# EasyEDA Pro project ProProject_FOC系列_2024-04-21.epro

# Schematic Schematic1
Create Date: 2023-11-13; Page Name: P1; Project Name: FOC系列; Schematic Name: Schematic1; Update Date: 2024-04-19; Company: 嘉立创EDA; Page Size: A4; Version: V1.0
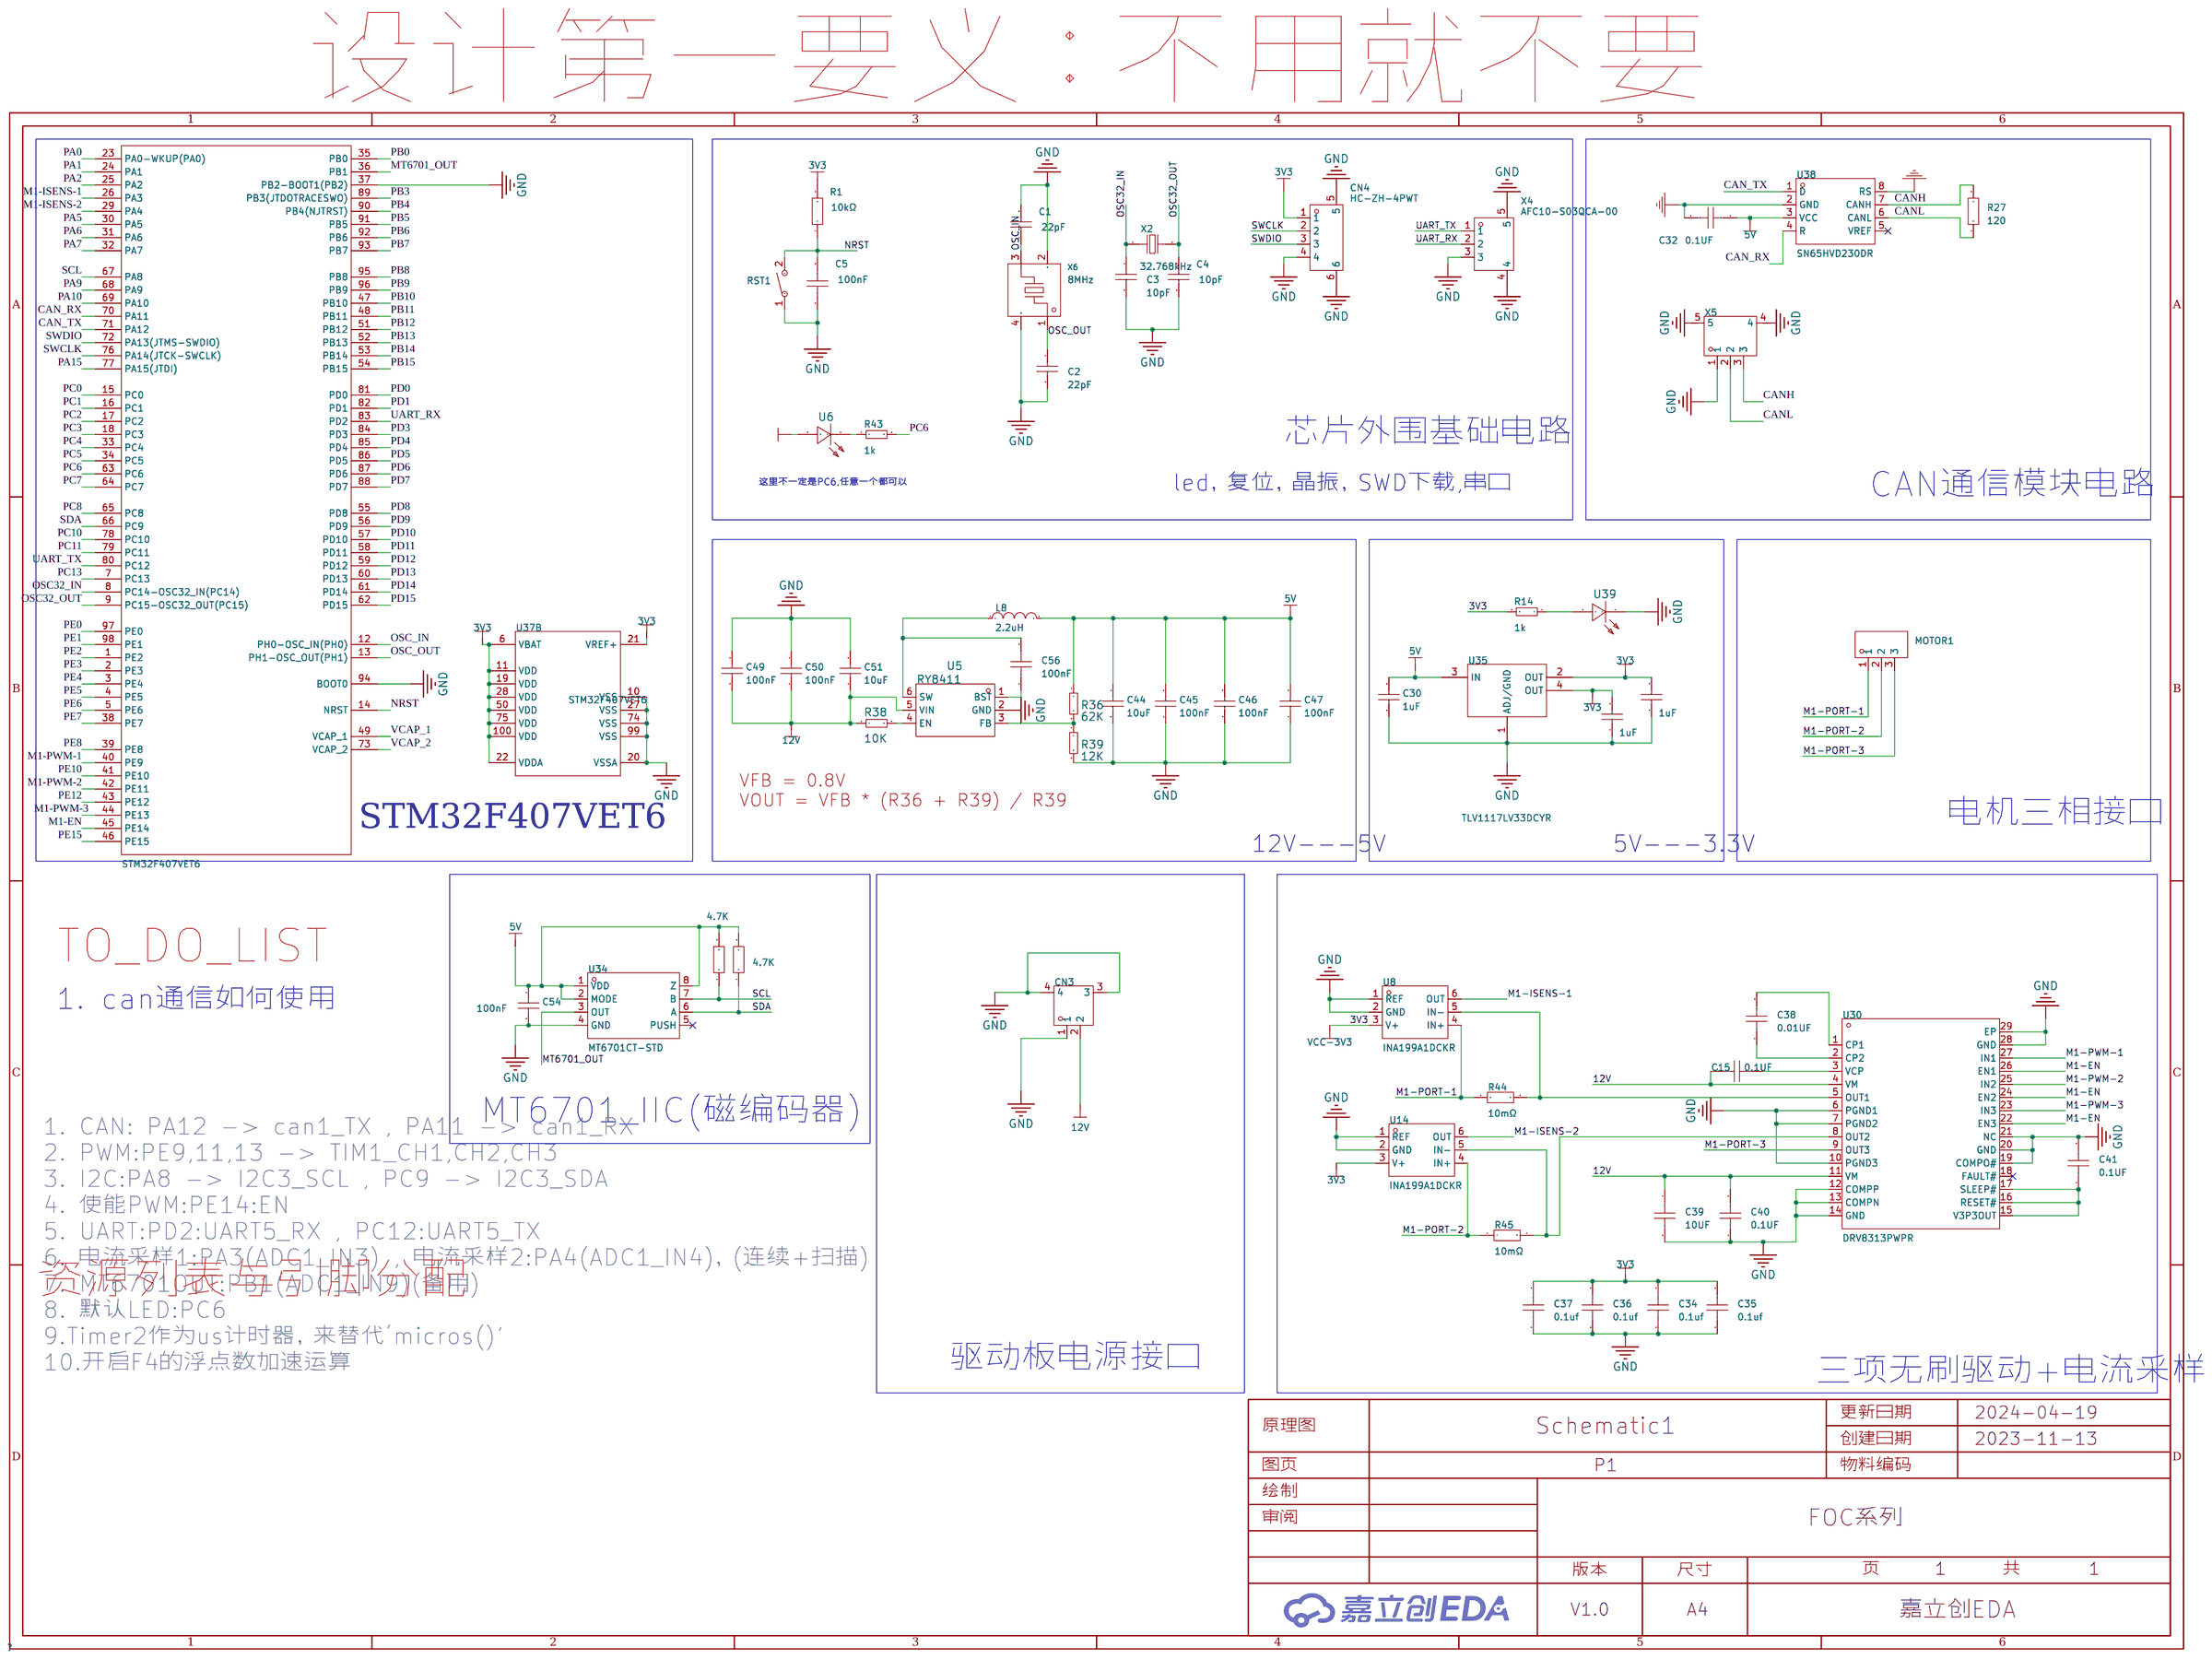
[diagram p0: schematic sheet]

## Parts
C1  22pF  [C0603]
C2  22pF  [C0603]
C3  10pF  [C0603]
C4  10pF  [C0603]
C5  100nF  [C0603]
C15  0.1UF  [c0603]
C30  1uF  [C0603_S]
C31  1uF  [C0603_S]
C32  0.1UF  [c0603]
C34  0.1uf  [c0603]
C35  0.1uf  [c0603]
C36  0.1uf  [c0603]
C37  0.1uf  [c0603]
C38  0.01UF  [c0603]
C39  10UF  [c0603]
C40  0.1UF  [c0603]
C41  0.1UF  [c0603]
C44  10uF  [C0805_S]
C45  100nF  [C0603_S]
C46  100nF  [C0603_S]
C47  100nF  [C0603_S]
C49  100nF  [C0603_S]
C50  100nF  [C0603_S]
C51  10uF  [C0603_S]
C54  100nF  [C0603_S]
C55  1uF  [C0603_S]
C56  100nF  [c0603]
CN3  XT30PW-M  [CONN-TH_XT30PW-M]
CN4  HC-ZH-4PWT  [CONN-SMD_4P-P1.50_HC-ZH-4PW]
L8  2.2uH  [IND-SMD_L3.0-W3.0]
MOTOR1  MR30-M  [mr30]
R1  10kΩ  [R0603]
R14  1k  [R0603_S]
R27  120  [r0603]
R36  62K  [R0603_S]
R38  10K  [R0603_S]
R39  12K  [R0603_S]
R41  4.7K  [R0603]
R42  4.7K  [R0603]
R43  1k  [R0603_S]
R44  10mΩ  [R1206]
R45  10mΩ  [R1206]
RST1  TS-1092S-B3D2-G  [SW-SMD_L6.1-W3.6-LS7.9]
U5  RY8411  [sot-23-6_l2.9-w1.6-p0.95-ls2.8-br]
U6  LED0603R-红色  [LED0603-RD]
U8  INA199A1DCKR  [SC-70-6_L2.0-W1.3-P0.65-LS2.1-BR]
U14  INA199A1DCKR  [SC-70-6_L2.0-W1.3-P0.65-LS2.1-BR]
U30  DRV8313PWPR  [HTSSOP-28_L9.8-W4.5-P0.65-LS6.6-BL-EP]
U34  MT6701CT-STD  [SOP-8_L4.9-W3.9-P1.27-LS6.0-BL]
U35  TLV1117LV33DCYR  [SOT-223_L6.7-W3.5-P2.30-BR]
U37  STM32F407VET6  [LQFP-100_L14.0-W14.0-P0.50-LS16.0-BL]  (sections 1,2)
U38  SN65HVD230DR  [SOIC-8_L4.9-W3.9-P1.27-LS6.0-BL]
U39  LED0603R-红色  [LED0603-RD]
X2  32.768kHz  [FC-135R_L3.2-W1.5]
X4  AFC10-S03QCA-00  [CONN-SMD_AFC10-S03QCA-00]
X5  AFC10-S03QCA-00  [CONN-SMD_AFC10-S03QCA-00]
X6  8MHz  [OSC-SMD_4P-L3.2-W2.5-BL]

## Library data of the parts
C1 C2 = CL10C220JB8NNNC: 容值:22pF;精度:±5%;额定电压:50V;材质(温度系数):C0G;; LCSC Part Name: 22pF ±5% 50V; Supplier Part: C1653; Manufacturer: SAMSUNG(三星); Supplier Footprint: 0603; JLCPCB Part Class: 基础库; Datasheet: https://atta.szlcsc.com/upload/public/pdf/source/20160103/1457707687317.pdf; Supplier: LCSC; Tolerance: ±5%; Voltage Rated: 50V; Temperature Coefficient: C0G
C3 C4 = CL10C100JB8NNNC: 容值:10pF;精度:±5%;额定电压:50V;材质(温度系数):C0G;; LCSC Part Name: 10pF ±5% 50V; Supplier Part: C1634; Manufacturer: SAMSUNG(三星); Supplier Footprint: 0603; JLCPCB Part Class: 基础库; Datasheet: https://atta.szlcsc.com/upload/public/pdf/source/20160103/1457707686163.pdf; Supplier: LCSC; Tolerance: ±5%; Voltage Rated: 50V; Temperature Coefficient: C0G
C5 = CC0603KRX7R9BB104: 容值:100nF;精度:±10%;额定电压:50V;材质(温度系数):X7R;; LCSC Part Name: 100nF ±10% 50V; Supplier Part: C14663; Manufacturer: YAGEO(国巨); Supplier Footprint: 0603; JLCPCB Part Class: 基础库; Datasheet: https://atta.szlcsc.com/upload/public/pdf/source/20170116/1484561234239.pdf; Supplier: LCSC; Tolerance: ±10%; Voltage Rated: 50V; Temperature Coefficient: X7R
C15 C32 C34-C41 = CAP_0805: Supplier Footprint: 0805
C30 C31 C45-C47 C49-C51 C54 C55 = C0603_S: Pin Type: IN
C44 = C0805_S: Pin Type: IN
C56 = CAP_0603: Supplier Footprint: 0603
CN3 = XT30PW-M: Socket,DCsupply,XT30,male,PIN:2; LCSC Part Name: AMASS(艾迈斯)航模插头 卧式弯脚 XT30PW-M公头; Supplier Part: C431092; Manufacturer: AMASS(艾迈斯); JLCPCB Part Class: 扩展库; Datasheet: https://atta.szlcsc.com/upload/public/pdf/source/20220222/6A9F22F7850E25B33E1BE430ADF8560B.pdf; Supplier: LCSC
CN4 = HC-ZH-4PWT: 参考系列:-;间距:1.5mm;插针结构:1x4P;排数:1;每排PIN数:4;行距:-;公母:公型插针;安装方式:卧贴;额定电流:2A;工作温度范围:-25℃~+85℃;; LCSC Part Name: 间距:1.5mm 1x4P 卧贴; Supplier Part: C2845426; Manufacturer: HCTL(华灿天禄); Supplier Footprint: SMD,P=1.5mm; JLCPCB Part Class: 扩展库; Datasheet: https://atta.szlcsc.com/upload/public/pdf/source/20230711/DA9605CC4FFDBF9FBAAF660CE8700658.pdf; Supplier: LCSC; Pitch: 1.5mm; Pins Structure: 1x4P; Number of Rows: 1; Number of PINs Per Row: 4; Gender: 公型插针; Mounting Style: 卧贴; Current Rating (Max): 2A; Operating Temperature Range: -25℃~+85℃
L8 = SWPA3015S2R2MT: 电感值:2.2uH;精度:±20%;额定电流:2A;; LCSC Part Name: 2.2uH ±20% 2A; Supplier Part: C43389; Manufacturer: Sunlord(顺络); Supplier Footprint: SMD; JLCPCB Part Class: 扩展库; Datasheet: https://atta.szlcsc.com/upload/public/pdf/source/20210916/AC798BA7E846B7D0B6818F45CD84DB0B.pdf; Supplier: LCSC; Tolerance: ±20%; Rated Current: 2A
MOTOR1 = MR30-M: 模型锂电连接器（两件套） 三芯; LCSC Part Name: AMASS(艾迈斯)锂电池三芯电源连接器公头MR30-M 2件套; Supplier Part: C99873; Manufacturer: AMASS(艾迈斯); JLCPCB Part Class: 扩展库; Datasheet: https://atta.szlcsc.com/upload/public/pdf/source/20170412/1491969315720.pdf; Supplier: LCSC
R1 = 0603WAF1002T5E: 电阻类型:厚膜电阻;阻值:10kΩ;精度:±1%;功率:100mW;温度系数:±100ppm/;最大工作电压:75V;工作温度范围:-55~+155;; LCSC Part Name: 10kΩ ±1% 100mW; Supplier Part: C25804; Manufacturer: UNI-ROYAL(厚声); Supplier Footprint: 0603; JLCPCB Part Class: 基础库; Datasheet: https://atta.szlcsc.com/upload/public/pdf/source/20200306/C422600_1E6D84923E4A46A82E41ADD87F860B5C.pdf; Supplier: LCSC; Type: 厚膜电阻; Tolerance: ±1%; Power(Watts): 100mW; Temperature Coefficient: ±100ppm/; Overload Voltage (Max): 75V; Operating Temperature Range: -55~+155
R14 R43 = R0603_S: Pin Type: IN
R27 = Res_0805: Supplier Footprint: 0805
R36 R38 R39 = R0603_S: Pin Type: IN; Manufacturer: UNI-ROYAL(厚声); Manufacturer Part: 0805W8F1001T5E; Supplier: LCSC; Supplier Part: C17513; 美岩编码: A00010; 单价: 0.009222
R41 R42 = Res_0603: Supplier Footprint: 0603
R44 R45 = RLM12FTCMR010: 阻值:10mΩ;精度:±1%;功率:1W;; LCSC Part Name: 10mΩ ±1% 1W; Supplier Part: C188070; Manufacturer: 大毅科技; Supplier Footprint: 1206; JLCPCB Part Class: 扩展库; Datasheet: https://atta.szlcsc.com/upload/public/pdf/source/20180329/C188070_3C58080BE0BA7DFA5ED79A3DCBDAA889.pdf; Supplier: LCSC; Tolerance: ±1%; Power(Watts): 1W; Temperature Coefficient: ±100ppm/℃
RST1 = TS-1092S-B3D2-G: 电路结构:单刀单掷;安装方式:立贴;按钮形状:矩形按钮;按钮/盖帽颜色:灰色;作用力:250gf@±30gf;引脚样式:鸥翼型;开关长度:6.1mm;开关宽度:3.6mm;开关高度:2.5mm;带支架:否;; LCSC Part Name: 轻触开关3.6*6.1*2.5灰头两脚贴片按键250gf; Supplier Part: C520860; Manufacturer: Yuandi(元迪); Supplier Footprint: SMD; JLCPCB Part Class: 扩展库; Datasheet: https://atta.szlcsc.com/upload/public/pdf/source/20200424/C520860_DA5AE47D9A9DC527FC720B5FF0895739.pdf; Supplier: LCSC; Circuit: 单刀单掷; Mounting Style: 立贴; Actuator Style: 矩形按钮; Actuator/Cap Color: 灰色; Operating Force: 250gf@±30gf; Pin Style: 鸥翼型; Switch Length: 6.1mm; Switch Width: 3.6mm; Switch Height: 2.5mm; Strike Gundam: 否
U5 = TD1466: Supplier: LCSC; Supplier Part: C185109; Manufacturer: JoulWatt Tech; Manufacturer Part: JW5026; JLCPCB Part Class: Extended Part
U6 U39 = LED0603R-红色: Supplier: LCSC; Supplier Part: C9900007960; Manufacturer: null; JLCPCB Part Class: Extended Part
U8 U14 = INA199B1DCKR: INA199 26V、双向、零漂移、低侧/高侧、电压输出分流监控器; Supplier Part: C398920; Manufacturer: TI(德州仪器); Supplier Footprint: SC-70-6; JLCPCB Part Class: 扩展库; Datasheet: https://atta.szlcsc.com/upload/public/pdf/source/20190618/C398920_11F1AA1C0E9C9D9BC4E845E2D57884D2.pdf; Supplier: LCSC
U30 = DRV8313PWPR: 类型:无刷直流BLDC;电源电压:8V~60V;输出电流:-;接口:并行;; Supplier Part: C92482; Manufacturer: TI(德州仪器); Supplier Footprint: HTSSOP-28-EP-4.5mm; JLCPCB Part Class: 扩展库; Datasheet: https://atta.szlcsc.com/upload/public/pdf/source/20180307/C92482_15204091381071407760.pdf; Supplier: LCSC; Type: 无刷直流BLDC; Supply Voltage: 8V~60V; Interface: 并行; Operating Temperature: -40℃~+150℃@(Tj)
U34 = MT6701CT-STD: 磁性编码器 磁性编码开关 磁性角度检测IC 可编程磁性角度位置芯片; LCSC Part Name: 霍尔在线编程角度位置传感器; Supplier Part: C2856764; Manufacturer: MagnTek(麦歌恩); Supplier Footprint: SOP-8; JLCPCB Part Class: 扩展库; Datasheet: https://atta.szlcsc.com/upload/public/pdf/source/20210901/89396AA55DF26524CEF7734A3D9C2FB3.pdf; Supplier: LCSC
U35 = TLV1117LV33DCYR: 输出类型:固定;输出极性:正;最大输入电压:5.5V;输出电压:3.3V;输出电流:1A;电源纹波抑制比(PSRR):75dB@(120Hz);; LCSC Part Name: 输入5.5V 输出3.3V 1A; Supplier Part: C15578; Manufacturer: TI(德州仪器); Supplier Footprint: SOT-223; JLCPCB Part Class: 扩展库; Datasheet: https://atta.szlcsc.com/upload/public/pdf/source/20140704/1457707105729.pdf; Supplier: LCSC; Output Type: 固定; Output Polarity: 正; Number of Outputs: 1; Maximum Input Voltage: 5.5V; Output Voltage: 3.3V; Dropout Voltage: 1.3V@(800mA); Output Current: 1A; Power Supply Rejection Ratio (PSRR): 75dB@(120Hz)
U37 = STM32F407VET6: CPU内核:ARM Cortex-M4;CPU最大主频:168MHz;工作电压范围:1.8V~3.6V;程序存储容量:512KB;程序存储器类型:FLASH;RAM总容量:192KB;GPIO端口数量:82;; Supplier Part: C28730; Manufacturer: ST(意法半导体); Supplier Footprint: LQFP-100(14x14); JLCPCB Part Class: 扩展库; Datasheet: https://atta.szlcsc.com/upload/public/pdf/source/20140801/1457707197138.pdf; Supplier: LCSC; CPU Core: ARM Cortex-M4; CPU Maximum Speed: 168MHz; Operating Voltage Range: 1.8V~3.6V; Program Storage Size: 512KB; Program Memory Type: FLASH; RAM Size: 192KB; GPIO Ports Number: 82; ADC (Bit): 12bit; DAC (Bit): 12bit; Universal Serial Bus: 有; Peripheral/Function: DMA；LCD/LED驱动；PWM; Watchdog: 有; Infrared Data Association: 有; Low-Voltage Detect: 有; LCD Module: 有; Direct Memory Access: 有; Internal Oscillator: 有; Operating Temperature Range: -40℃~+85℃
U38 = SN65HVD230DR: 类型:收发器;数据速率:1Mbps;; LCSC Part Name: 1Mbps 3V~3.6V; Supplier Part: C12084; Manufacturer: TI(德州仪器); Supplier Footprint: SOIC-8; JLCPCB Part Class: 扩展库; Datasheet: https://atta.szlcsc.com/upload/public/pdf/source/20140508/1457707055452.pdf; Supplier: LCSC; Type: 收发器; Data Rate: 1Mbps; Supply Voltage: 3V~3.6V
X2 = Q13FC1350000400: 晶振类型:贴片无源晶振;频率:32.768kHz;频率公差:±20ppm;负载电容:12.5pF;等效串联电阻(ESR):70kΩ;工作温度:-40~+85;; LCSC Part Name: 32.768kHz ±20ppm 12.5pF; Supplier Part: C32346; Manufacturer: EPSON(爱普生); Supplier Footprint: SMD3215-2P; Datasheet: https://atta.szlcsc.com/upload/public/pdf/source/20190108/C32346_746D6B07EAF90824457A96480007685F.pdf; Supplier: LCSC; Crystal Type: 贴片无源晶振; Frequency Tolerance: ±20ppm; Load Capacitance: 12.5pF; Equivalent Series Resistance (ESR): 70kΩ; Operating Temperature: -40~+85
X4 X5 = AFC10-S03QCA-00: 参考系列:SH;间距:1mm;插针结构:1x3P;排数:1;每排PIN数:3;行距:-;公母:公型插针;安装方式:卧贴;额定电流:500mA;工作温度范围:-25℃~+85℃;; LCSC Part Name: 系列:SH 间距:1mm 1x3P 卧贴; Supplier Part: C2764182; Manufacturer: JS(钜硕电子); Supplier Footprint: SMD,P=1mm; JLCPCB Part Class: 扩展库; Datasheet: https://atta.szlcsc.com/upload/public/pdf/source/20210330/C2764181_391AED87194E28CE940989A69A8EDCC4.pdf; Supplier: LCSC; Reference Series: SH; Pitch: 1mm; Pins Structure: 1x3P; Number of Rows: 1; Number of PINs Per Row: 3; Gender: 公型插针; Mounting Style: 卧贴; Current Rating (Max): 500mA; Operating Temperature Range: -25℃~+85℃
X6 = X32258MOB4SI: 频率:8MHz;频率公差:±10ppm;负载电容:12pF;; LCSC Part Name: 8MHz ±10ppm 12pF YSX321SL; Supplier Part: C2682775; Manufacturer: YXC(扬兴晶振); Supplier Footprint: SMD3225-4P; JLCPCB Part Class: 扩展库; Datasheet: https://atta.szlcsc.com/upload/public/pdf/source/20210106/C2682774_0CD4FDA5D9DA3FBEEC23BD607A48E4B0.pdf; Supplier: LCSC; Crystal Type: 贴片无源晶振; Frequency Tolerance: ±10ppm; Frequency Stability: ±30ppm; Load Capacitance: 12pF; Equivalent Series Resistance (ESR): 150Ω; Operating Temperature: -40℃~+85℃

## Nets
3V3: C31.2 C34.1 C35.2 C36.1 C37.1 C55.2 CN4.1 R1.2 R14.2 U6.2(A) U8.3(V+) U14.3(V+) U35.2(OUT) U35.4(OUT) U37.6(VBAT) U37.11(VDD) U37.19(VDD) U37.21(VREF+) U37.22(VDDA) U37.28(VDD) U37.50(VDD) U37.75(VDD) U37.100(VDD)
5V: C30.2 C32.1 C44.1 C45.2 C46.2 C47.2 C54.1 L8.2 R36.1 R41.2 R42.2 U34.1(VDD) U34.2(MODE) U34.8(Z) U35.3(IN) U38.3(VCC)
12V: C15.2 C39.1 C40.2 C49.2 C50.2 C51.1 CN3.2 R38.1 U5.5(VIN) U30.4(VM) U30.11(VM)
GND: C1.2 C2.2 C3.2 C4.1 C5.1 C30.1 C31.1 C32.2 C34.2 C35.1 C36.2 C37.2 C39.2 C40.1 C41.2 C44.2 C45.1 C46.1 C47.1 C49.1 C50.1 C51.2 C54.2 C55.1 CN3.1 CN3.3 CN3.4 CN4.4 CN4.5 CN4.6 R39.2 RST1.1 U5.2(GND) U8.1(REF) U8.2(GND) U14.1(REF) U14.2(GND) U30.6(PGND1) U30.7(PGND2) U30.10(PGND3) U30.12(COMPP) U30.13(COMPN) U30.14(GND) U30.19(COMPO#) U30.20(GND) U30.21(NC) U30.28(GND) U30.29(EP) U34.4(GND) U35.1(ADJ/GND) U37.10(VSS) U37.20(VSSA) U37.27(VSS) U37.37(PB2-BOOT1(PB2)) U37.74(VSS) U37.94(BOOT0) U37.99(VSS) U38.2(GND) U38.8(RS) U39.1(K) X4.3 X4.4 X4.5 X5.1 X5.4 X5.5 X6.2(GND) X6.4(GND)
CAN_RX: U37.70(PA11) U38.4(R)
CAN_TX: U37.71(PA12) U38.1(D)
CANH: R27.2 U38.7(CANH) X5.3
CANL: R27.1 U38.6(CANL) X5.2
M1-EN: U30.22(EN3) U30.24(EN2) U30.26(EN1) U37.45(PE14)
M1-ISENS-1: U8.6(OUT) U37.26(PA3)
M1-ISENS-2: U14.6(OUT) U37.29(PA4)
M1-PORT-1: MOTOR1.1 R44.1 U8.4(IN+)
M1-PORT-2: MOTOR1.2 R45.1 U14.4(IN+)
M1-PORT-3: MOTOR1.3 U30.9(OUT3)
M1-PWM-1: U30.27(IN1) U37.40(PE9)
M1-PWM-2: U30.25(IN2) U37.42(PE11)
M1-PWM-3: U30.23(IN3) U37.44(PE13)
MT6701_OUT: U34.3(OUT) U37.36(PB1)
NRST: C5.2 R1.1 RST1.2 U37.14(NRST)
OSC32_IN: C3.1 U37.8(PC14-OSC32_IN(PC14)) X2.1
OSC32_OUT: C4.2 U37.9(PC15-OSC32_OUT(PC15)) X2.2
OSC_IN: C1.1 U37.12(PH0-OSC_IN(PH0)) X6.3
OSC_OUT: C2.1 U37.13(PH1-OSC_OUT(PH1)) X6.1
PA0: U37.23(PA0-WKUP(PA0))
PA1: U37.24(PA1)
PA2: U37.25(PA2)
PA5: U37.30(PA5)
PA6: U37.31(PA6)
PA7: U37.32(PA7)
PA9: U37.68(PA9)
PA10: U37.69(PA10)
PA15: U37.77(PA15(JTDI))
PB0: U37.35(PB0)
PB3: U37.89(PB3(JTDOTRACESWO))
PB4: U37.90(PB4(NJTRST))
PB5: U37.91(PB5)
PB6: U37.92(PB6)
PB7: U37.93(PB7)
PB8: U37.95(PB8)
PB9: U37.96(PB9)
PB10: U37.47(PB10)
PB11: U37.48(PB11)
PB12: U37.51(PB12)
PB13: U37.52(PB13)
PB14: U37.53(PB14)
PB15: U37.54(PB15)
PC0: U37.15(PC0)
PC1: U37.16(PC1)
PC2: U37.17(PC2)
PC3: U37.18(PC3)
PC4: U37.33(PC4)
PC5: U37.34(PC5)
PC6: R43.2 U37.63(PC6)
PC7: U37.64(PC7)
PC8: U37.65(PC8)
PC10: U37.78(PC10)
PC11: U37.79(PC11)
PC13: U37.7(PC13)
PD0: U37.81(PD0)
PD1: U37.82(PD1)
PD3: U37.84(PD3)
PD4: U37.85(PD4)
PD5: U37.86(PD5)
PD6: U37.87(PD6)
PD7: U37.88(PD7)
PD8: U37.55(PD8)
PD9: U37.56(PD9)
PD10: U37.57(PD10)
PD11: U37.58(PD11)
PD12: U37.59(PD12)
PD13: U37.60(PD13)
PD14: U37.61(PD14)
PD15: U37.62(PD15)
PE0: U37.97(PE0)
PE1: U37.98(PE1)
PE2: U37.1(PE2)
PE3: U37.2(PE3)
PE4: U37.3(PE4)
PE5: U37.4(PE5)
PE6: U37.5(PE6)
PE7: U37.38(PE7)
PE8: U37.39(PE8)
PE10: U37.41(PE10)
PE12: U37.43(PE12)
PE15: U37.46(PE15)
SCL: R41.1 U34.7(B) U37.67(PA8)
SDA: R42.1 U34.6(A) U37.66(PC9)
SWCLK: CN4.2 U37.76(PA14(JTCK-SWCLK))
SWDIO: CN4.3 U37.72(PA13(JTMS-SWDIO))
UART_RX: U37.83(PD2) X4.2
UART_TX: U37.80(PC12) X4.1
VCAP_1: U37.49(VCAP_1)
VCAP_2: U37.73(VCAP_2)
$1N4932: C38.2 U30.1(CP1)
$1N4937: C41.1 U30.15(V3P3OUT) U30.16(RESET#) U30.17(SLEEP#)
$1N5006: C15.1 U30.3(VCP)
$1N5007: C38.1 U30.2(CP2)
$1N9353: R36.2 R39.1 U5.3(FB)
$1N9354: C56.2 L8.1 U5.6(SW)
$1N9355: C56.1 U5.1(BST)
$1N9357: R38.2 U5.4(EN)
$1N9890: R14.1 U39.2(A)
$1N21410: R43.1 U6.1(K)
$1N26766: R44.2 U8.5(IN-) U30.5(OUT1)
$1N26776: R45.2 U14.5(IN-) U30.8(OUT2)

Not connected (* = marked no-connect by the designer): U30 18(FAULT#)*; U34 5(PUSH)*; U38 5(VREF)*

## Notes on the sheet
- 设计第一要义：不用就不要
- 芯片外围基础电路
- 这里不一定是PC6,任意一个都可以
- led，复位，晶振，SWD下载,串口
- CAN通信模块电路
- VFB = 0.8V
- STM32F407VET6
- VOUT = VFB * (R36 + R39) / R39
- 电机三相接口
- 12V---5V
- 5V---3.3V
- TO_DO_LIST
- 1. can通信如何使用
- MT6701_IIC(磁编码器)
- 资源列表与引脚分配
- 1. CAN: PA12 -> can1_TX , PA11 -> can1_RX
  2. PWM:PE9,11,13 -> TIM1_CH1,CH2,CH3
  3. I2C:PA8 -> I2C3_SCL , PC9 -> I2C3_SDA
  4. 使能PWM:PE14:EN
  5. UART:PD2:UART5_RX , PC12:UART5_TX
  6. 电流采样1:PA3(ADC1_IN3) , 电流采样2:PA4(ADC1_IN4)，(连续+扫描)
  7. MT6701OUT:PB1(ADC1_IN9)(备用)
  8. 默认LED:PC6
  9.Timer2作为us计时器，来替代‘micros()’
  10.开启F4的浮点数加速运算
- 驱动板电源接口
- 三项无刷驱动+电流采样

# Board PCB1
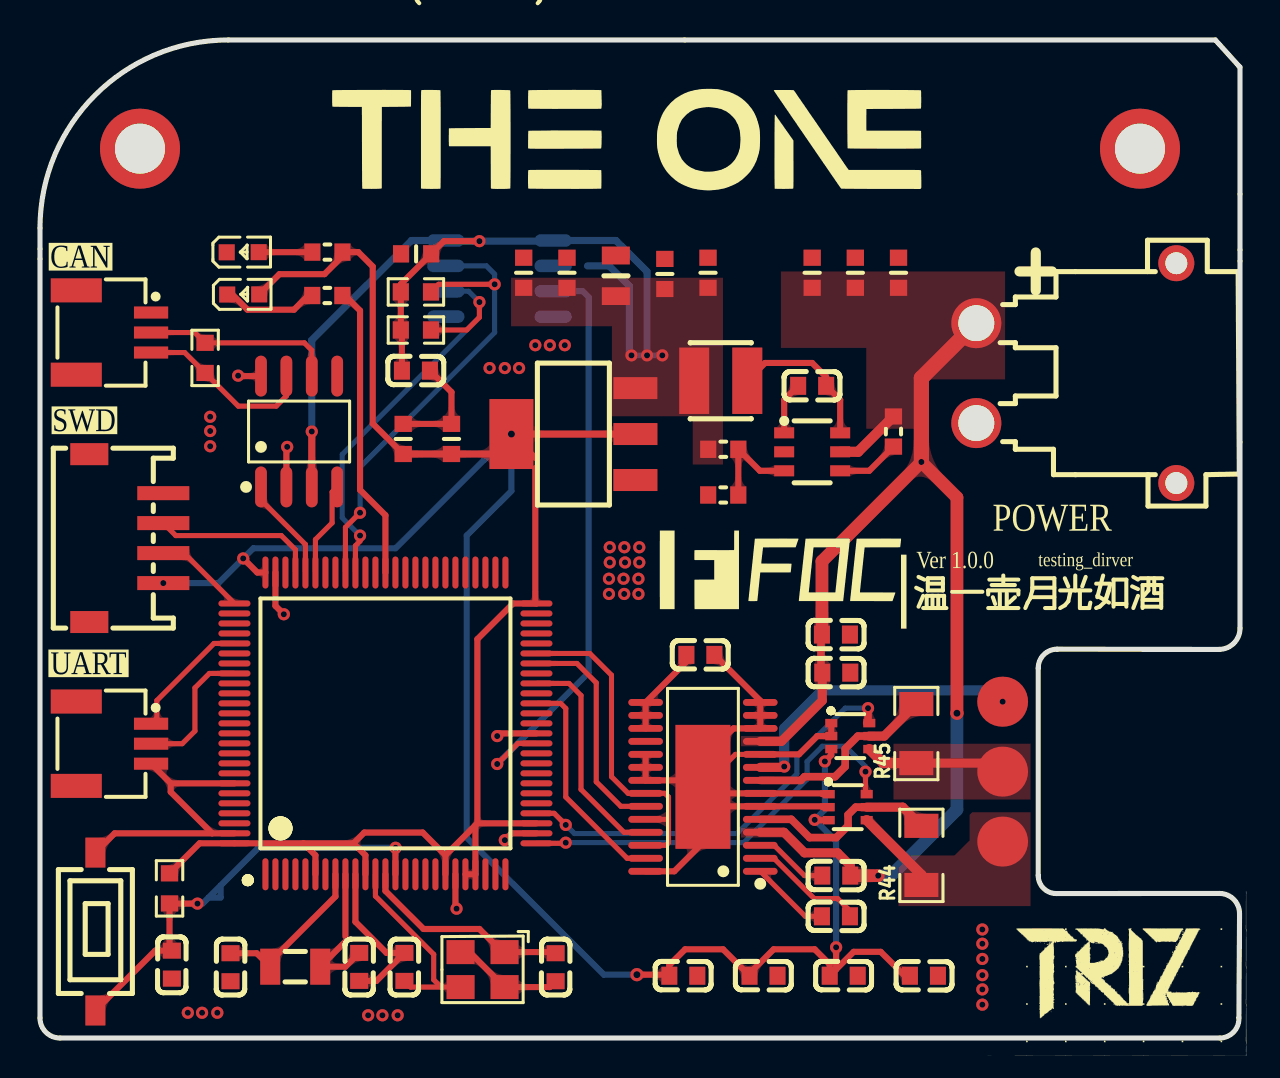
[diagram p1: board, top side]
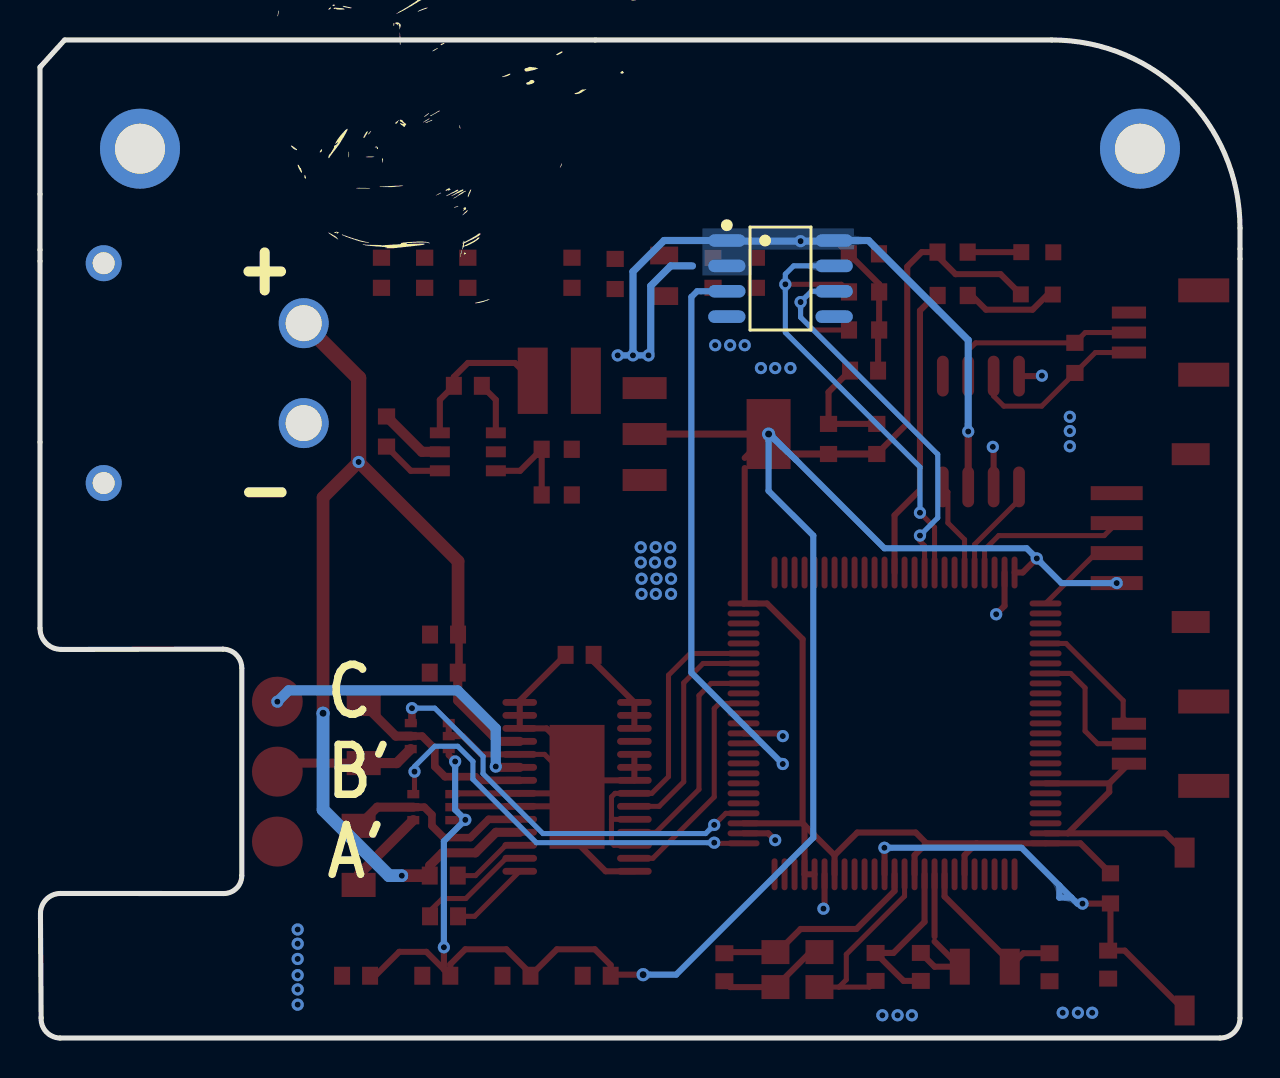
[diagram p2: board, bottom side, seen from below]

Outline 60 x 49.94 mm; copper layers: Top Layer, Bottom Layer. Coordinates in mm from the lower left corner of the outline.
Outline path: 0,40.52 arc(2.76,47.18) 9.42,49.94 58.77,49.94 59.94,48.64 60,48.58 60,20.5 arc(59.69,19.75) 58.95,19.44 50.86,19.46 arc(50.19,19.18) 49.91,18.51 49.91,8.13 arc(50.17,7.49) 50.81,7.23 58.98,7.23 arc(59.69,6.94) 59.98,6.23 59.98,5.97 59.94,1.01 arc(59.69,0.31) 59,0 1,0 arc(0.29,0.29) 0,1 0,40.52
Stack: Top Layer 0.035mm / Dielectric1 1.51mm FR4 er 4.5 / Bottom Layer 0.035mm

## Design rules (mm)
template: JLCPCB Capability(Two Layers Board)
spacing copperThickness1oz (default): track to track 0.102, other pairs 0.152 to 0.3
spacing copperThickness2oz: track to track 0.203, other pairs 0.152 to 0.3
track width copperThickness1oz (default): min 0.127, default 0.254, max 2.54
track width copperThickness2oz: min 0.203, default 0.254, max 2.54
differential pair differentialPair (default): width min 0.127, default 0.254, max 2.54; gap min 0.152, default 0.152
via viaSize (default): diameter min 0.5, default 0.61, max 10; hole min 0.3, default 0.305, max 6.3

## Placement (name value [footprint] x y rotation side)
C1  22pF  [C0603]  18.22 3.56 90 top
C2  22pF  [C0603]  25.78 3.54 270 top
C3  10pF  [C0603]  9.53 3.54 270 top
C4  10pF  [C0603]  15.96 3.56 90 top
C5  100nF  [C0603]  6.59 3.67 90 top
C15  0.1UF  [c0603]  39.81 8.13 0 top
C30  1uF  [C0603_S]  33.4 38.28 270 top
C31  1uF  [C0603_S]  18.16 29.97 270 top
C32  0.1UF  [c0603]  18.8 33.4 0 top
C34  0.1uf  [c0603]  40.19 3.12 0 top
C35  0.1uf  [c0603]  44.2 3.12 180 top
C36  0.1uf  [c0603]  36.18 3.12 0 top
C37  0.1uf  [c0603]  32.17 3.12 0 top
C38  0.01UF  [c0603]  39.8 6.09 180 top
C39  10UF  [c0603]  39.81 18.28 0 top
C40  0.1UF  [c0603]  39.8 20.19 180 top
C41  0.1UF  [c0603]  33.02 19.17 0 top
C44  10uF  [C0805_S]  28.79 38.14 270 top
C45  100nF  [C0603_S]  26.35 38.28 270 top
C46  100nF  [C0603_S]  24.18 38.28 270 top
C47  100nF  [C0603_S]  31.24 38.22 270 top
C49  100nF  [C0603_S]  38.61 38.28 270 top
C50  100nF  [C0603_S]  40.77 38.28 270 top
C51  10uF  [C0603_S]  42.93 38.3 90 top
C54  100nF  [C0603_S]  18.8 39.24 180 top
C55  1uF  [C0603_S]  20.57 29.97 270 top
C56  100nF  [c0603]  38.61 32.63 0 top
CN3  XT30PW-M  [CONN-TH_XT30PW-M]  51.82 33.27 90 top
CN4  HC-ZH-4PWT  [CONN-SMD_4P-P1.50_HC-ZH-4PW]  4.31 25.01 90 top
L8  2.2uH  [IND-SMD_L3.0-W3.0]  34.04 32.89 0 top
MOTOR1  MR30-M  [mr30]  52.96 13.08 0 top
NOREF  -  [Pad_e56674]  5 44.5 0 top
NOREF#2  -  [Pad_e56647]  55 44.5 0 top
R1  10kΩ  [R0603]  6.48 7.49 90 top
R14  1k  [R0603_S]  14.37 39.32 0 top
R27  120  [r0603]  8.25 34.03 270 top
R36  62K  [R0603_S]  34.16 29.46 0 top
R38  10K  [R0603_S]  42.67 30.35 270 top
R39  12K  [R0603_S]  34.16 27.17 180 top
R41  4.7K  [R0603]  18.8 37.33 180 top
R42  4.7K  [R0603]  18.8 35.43 180 top
R43  1k  [R0603_S]  14.36 37.15 0 top
R44  10mΩ  [R1206]  44.07 9.14 90 top
R45  10mΩ  [R1206]  43.81 15.23 90 top
RST1  TS-1092S-B3D2-G  [SW-SMD_L6.1-W3.6-LS7.9]  2.77 5.33 270 top
U5  RY8411  [sot-23-6_l2.9-w1.6-p0.95-ls2.8-br]  38.61 29.33 180 top
U6  LED0603R-红色  [LED0603-RD]  10.16 37.21 0 top
U8  INA199A1DCKR  [SC-70-6_L2.0-W1.3-P0.65-LS2.1-BR]  40.39 11.55 180 top
U14  INA199A1DCKR  [SC-70-6_L2.0-W1.3-P0.65-LS2.1-BR]  40.51 15.11 180 top
U30  DRV8313PWPR  [HTSSOP-28_L9.8-W4.5-P0.65-LS6.6-BL-EP]  33.15 12.57 90 top
U34  MT6701CT-STD  [SOP-8_L4.9-W3.9-P1.27-LS6.0-BL]  22.97 38 270 bottom
U35  TLV1117LV33DCYR  [SOT-223_L6.7-W3.5-P2.30-BR]  26.67 30.22 0 top
U37  STM32F407VET6  [LQFP-100_L14.0-W14.0-P0.50-LS16.0-BL]  17.27 15.74 0 top
U38  SN65HVD230DR  [SOIC-8_L4.9-W3.9-P1.27-LS6.0-BL]  12.95 30.35 0 top
U39  LED0603R-红色  [LED0603-RD]  10.13 39.32 0 top
X2  32.768kHz  [FC-135R_L3.2-W1.5]  12.76 3.57 0 top
X4  AFC10-S03QCA-00  [CONN-SMD_AFC10-S03QCA-00]  3.68 14.73 90 top
X5  AFC10-S03QCA-00  [CONN-SMD_AFC10-S03QCA-00]  3.68 35.3 90 top
X6  8MHz  [OSC-SMD_4P-L3.2-W2.5-BL]  22.13 3.42 180 top

## Footprints (pads in the part's own frame, mm; a bottom-side part is the same pattern mirrored in y, then rotated)
C0603
  rect 0.8x0.9 smd: 1(-0.7,0) 2(0.7,0)
c0603
  rect 0.8x0.9 smd: 1(-0.7,0) 2(0.7,0)
C0603_S
  rect 0.806x0.864 smd: 1(-0.762,0) 2(0.745,0)
C0805_S
  rect 0.889x1.399 smd: 1(1.016,0) 2(-1.016,0)
CONN-SMD_4P-P1.50_HC-ZH-4PW
  rect 0.7x2.6 smd: 1(-2.25,-1.85) 2(-0.75,-1.85) 3(0.75,-1.85) 4(2.25,-1.85)
  rect 1.1x1.9 smd: 5(4.2,1.85) 6(-4.2,1.85)
CONN-SMD_AFC10-S03QCA-00
  rect 0.6x1.71 smd: 1(1,-1.87) 2(0,-1.87) 3(-1,-1.87)
  rect 1.2x2.55 smd: 4(-2.11,1.87) 5(2.11,1.87)
CONN-TH_XT30PW-M
  round 2.5 hole 1.8: 1(-2.5,5) 2(2.5,5)
  round 1.8 hole 1.1: 3(5.5,-5) 4(-5.5,-5)
FC-135R_L3.2-W1.5
  rect 1x1.8 smd: 1(-1.25,0) 2(1.25,0)
HTSSOP-28_L9.8-W4.5-P0.65-LS6.6-BL-EP
  oval 0.343x1.732 smd: 1(-4.225,-2.866) 2(-3.575,-2.866) 3(-2.925,-2.866) 4(-2.275,-2.866) 5(-1.625,-2.866) 6(-0.975,-2.866) 7(-0.325,-2.866) 8(0.325,-2.866) 9(0.975,-2.866) 10(1.625,-2.866) 11(2.275,-2.866) 12(2.925,-2.866) 13(3.575,-2.866) 14(4.225,-2.866) 15(4.225,2.866) 16(3.575,2.866) 17(2.925,2.866) 18(2.275,2.866) 19(1.625,2.866) 20(0.975,2.866) 21(0.325,2.866) 22(-0.325,2.866) 23(-0.975,2.866) 24(-1.625,2.866) 25(-2.275,2.866) 26(-2.925,2.866) 27(-3.575,2.866) 28(-4.225,2.866)
  rect 6.2x2.75 smd: 29(0,0)
IND-SMD_L3.0-W3.0
  rect 1.5x3.32 smd: 1(1.328,0) 2(-1.328,0)
LED0603-RD
  rect 0.8x0.8 smd: 1(-0.799,-0.004) 2(0.799,0.004)
LQFP-100_L14.0-W14.0-P0.50-LS16.0-BL
  oval 0.3x1.6 smd: 1(-6,-7.55) 2(-5.5,-7.55) 3(-5,-7.55) 4(-4.5,-7.55) 5(-4,-7.55) 6(-3.5,-7.55) 7(-3,-7.55) 8(-2.5,-7.55) 9(-2,-7.55) 10(-1.5,-7.55) 11(-1,-7.55) 12(-0.5,-7.55) 13(0,-7.55) 14(0.5,-7.55) 15(1,-7.55) 16(1.5,-7.55) 17(2,-7.55) 18(2.5,-7.55) 19(3,-7.55) 20(3.5,-7.55) 21(4,-7.55) 22(4.5,-7.55) 23(5,-7.55) 24(5.5,-7.55) 25(6,-7.55) 51(6,7.55) 52(5.5,7.55) 53(5,7.55) 54(4.5,7.55) 55(4,7.55) 56(3.5,7.55) 57(3,7.55) 58(2.5,7.55) 59(2,7.55) 60(1.5,7.55) 61(1,7.55) 62(0.5,7.55) 63(0,7.55) 64(-0.5,7.55) 65(-1,7.55) 66(-1.5,7.55) 67(-2,7.55) 68(-2.5,7.55) 69(-3,7.55) 70(-3.5,7.55) 71(-4,7.55) 72(-4.5,7.55) 73(-5,7.55) 74(-5.5,7.55) 75(-6,7.55)
  oval 1.6x0.3 smd: 26(7.55,-6) 27(7.55,-5.5) 28(7.55,-5) 29(7.55,-4.5) 30(7.55,-4) 31(7.55,-3.5) 32(7.55,-3) 33(7.55,-2.5) 34(7.55,-2) 35(7.55,-1.5) 36(7.55,-1) 37(7.55,-0.5) 38(7.55,0) 39(7.55,0.5) 40(7.55,1) 41(7.55,1.5) 42(7.55,2) 43(7.55,2.5) 44(7.55,3) 45(7.55,3.5) 46(7.55,4) 47(7.55,4.5) 48(7.55,5) 49(7.55,5.5) 50(7.55,6) 76(-7.55,6) 77(-7.55,5.5) 78(-7.55,5) 79(-7.55,4.5) 80(-7.55,4) 81(-7.55,3.5) 82(-7.55,3) 83(-7.55,2.5) 84(-7.55,2) 85(-7.55,1.5) 86(-7.55,1) 87(-7.55,0.5) 88(-7.55,0) 89(-7.55,-0.5) 90(-7.55,-1) 91(-7.55,-1.5) 92(-7.55,-2) 93(-7.55,-2.5) 94(-7.55,-3) 95(-7.55,-3.5) 96(-7.55,-4) 97(-7.55,-4.5) 98(-7.55,-5) 99(-7.55,-5.5) 100(-7.55,-6)
mr30
  rrect 2.54x2.5 smd: 1(-4.826,-3.246) 2(-4.826,0.254) 3(-4.826,3.754)
OSC-SMD_4P-L3.2-W2.5-BL
  rect 1.4x1.2 smd: 1(-1.1,-0.875) 2(1.1,-0.875) 3(1.1,0.875) 4(-1.1,0.875)
Pad_e56647
  round 4 hole 2.5: 101(0,0)
Pad_e56674
  round 4 hole 2.5: 101(0,0)
R0603
  rect 0.806x0.864 smd: 1(-0.753,0) 2(0.753,0)
r0603
  rect 0.806x0.864 smd: 1(-0.753,0) 2(0.753,0)
R0603_S
  rect 0.806x0.864 smd: 1(-0.752,0) 2(0.754,0)
R1206
  rect 1.208x1.701 smd: 1(-1.479,0) 2(1.479,0)
SC-70-6_L2.0-W1.3-P0.65-LS2.1-BR
  rect 0.6x0.42 smd: 1(0.95,-0.65) 2(0.95,0) 3(0.95,0.65) 4(-0.95,0.65) 5(-0.95,0) 6(-0.95,-0.65)
SOIC-8_L4.9-W3.9-P1.27-LS6.0-BL
  oval 0.588x2.045 smd: 1(-1.905,-2.772) 2(-0.635,-2.772) 3(0.635,-2.772) 4(1.905,-2.772) 5(1.905,2.772) 6(0.635,2.772) 7(-0.635,2.772) 8(-1.905,2.772)
SOP-8_L4.9-W3.9-P1.27-LS6.0-BL
  oval 0.63x1.865 smd: 1(-1.905,-2.683) 2(-0.635,-2.683) 3(0.635,-2.683) 4(1.905,-2.683) 5(1.905,2.683) 6(0.635,2.683) 7(-0.635,2.683) 8(-1.905,2.683)
sot-23-6_l2.9-w1.6-p0.95-ls2.8-br
  rect 1x0.55 smd: 1(1.4,-0.95) 2(1.4,0) 3(1.4,0.95) 4(-1.4,0.95) 5(-1.4,0) 6(-1.4,-0.95)
SOT-223_L6.7-W3.5-P2.30-BR
  rect 2.2x1.1 smd: 1(3.099,-2.3) 2(3.099,0) 3(3.099,2.3)
  rect 2.2x3.5 smd: 4(-3.099,0)
SW-SMD_L6.1-W3.6-LS7.9
  rect 1.5x1 smd: 1(-3.95,0) 2(3.95,0)

## Nets
As in the schematic.

Pads without a net: NOREF 101; NOREF#2 101; U30 18; U34 5; U38 5

## Via types
v1: diameter 0.61, hole 0.305, Top Layer to Bottom Layer, 64 vias
v2: diameter 0.66, hole 0.355, Top Layer to Bottom Layer, 3 vias

## Routing (per net, layer and track width the routed paths; a pad name or vN(x,y) marks a point on that pad's centre or on a via; arc(x,y) is an arc through that point)
3V3: length 164.1
  Top Layer w0.305: v1(38.74,10.92) 38.75,10.9 U8.3 ; C31.2 16.64,30.75 16.64,38.6 15.92,39.32 R14.2 15.12,39.12 14.22,38.22 11.97,38.22 11.09,37.34 ; v1(10.16,24) 10.87,23.29 U37.75 ; U37.11 16.27,9.15 15.67,9.74 ; U37.21 U37.22 21.77,10.65 ; 20.27,9.15 19.14,10.28 16.21,10.28 15.67,9.74 ; 20.27,9.15 U37.19 ; 20.27,9.15 21.77,10.65 ; v2(29.84,3.17) 31.41,3.17 C37.1 31.47,3.65 32.26,4.44 34.15,4.44 35.42,3.18 ; 24.76,28.52 24.76,21.8 U37.50 23.65,21.74 21.87,19.96 21.87,10.74 ; 13.17,9.74 U37.100 7.98,9.74 R1.2 ; 13.17,9.74 15.67,9.74 ; 13.17,9.74 13.77,9.15 U37.6 ; 39.81,3.44 C34.1 39.49,3.69 38.74,4.44 36.68,4.44 35.42,3.18 ; 39.81,3.44 v1(39.81,4.54) ; 39.81,3.44 40.68,4.31 42.04,4.31 43.23,3.12 C35.2 ; 21.77,10.65 21.87,10.74 ; 21.87,10.74 U37.28 ; 35.42,3.18 C36.1 ; 24.76,29.03 v2(23.57,30.22) ; U14.3 39.56,14.16 v1(39.24,13.84)
  Top Layer w0.355: C31.2 C55.2 23.08,29.22 ; U35.2 v2(23.57,30.22) 23.08,29.73
  Bottom Layer w0.305: v1(39.24,13.84) 39.24,11.42 v1(38.74,10.92) 39.81,9.85 v1(39.81,4.54) ; v2(23.57,30.22) 23.5,30.22 22.21,28.94 ; v2(23.57,30.22) 22.21,28.94 ; v2(23.57,30.22) 23.57,27.38 21.34,25.14 21.34,10.03 28.19,3.17 v2(29.84,3.17) ; 22.21,28.94 17.78,24.51 10.67,24.51 v1(10.16,24) 8.93,22.76 v1(6.17,22.76)
5V: length 47.8
  Top Layer w0.305: v1(21.97,39.87) 20.19,39.87 C54.1 18.04,37.72 R41.2 R42.2 18.1,35.37 C32.1
  Top Layer w0.355: v1(13.59,30.35) U38.3
  Bottom Layer w0.305: v1(31.12,34.16) v1(30.35,34.16) v1(29.57,34.16)
  Bottom Layer w0.355: v1(29.57,34.16) 29.46,34.27 29.46,37.63 28.46,38.64 27.38,38.64 ; v1(30.35,34.16) 30.35,38.35 28.8,39.91 U34.1 25.63,39.87 v1(21.97,39.87) 20.32,39.87 U34.8 18.57,39.91 13.59,34.92 v1(13.59,30.35)
12V: length 59.7
  Top Layer w0.381: 39.05,19.93 39.05,18.28
  Top Layer w0.457: C39.1 39.11,16.88 37.07,14.84 U30.11 ; U30.4 37.2,10.29 38.23,9.27 39.88,9.27 40.51,8.63 C15.2
  Top Layer w0.508: U5.5 40.9,29.33 R38.1
  Top Layer w0.635: v2(45.85,16.25) 45.85,27.05 v1(44.07,28.82) 39.1,23.85 C40.2 ; C15.2 40.52,8.12 v1(41.91,8.12)
  Top Layer w0.762: CN3.2 44.07,33.02 v1(44.07,28.82)
  Bottom Layer w0.635: v2(45.85,16.25) 45.85,11.42 42.54,8.12 v1(41.91,8.12)
GND: length 84.9
  Top Layer w0.254: U30.10 34.77,14.19 34.06,13.48
  Top Layer w0.305: 8.61,10.24 U37.99 ; 8.61,10.24 3.73,10.24 RST1.1 ; 8.61,10.24 6.54,12.31 6.54,12.74 ; 32.82,12.89 U30.21 U30.19 ; 32.82,12.89 32.65,13.07 ; 32.82,12.89 U30.29 ; U14.1 U14.2 38.86,15.11 37.95,14.19 U30.10 ; U30.29 33.15,9.77 31.72,8.34 U30.28 ; U30.29 33.15,13.97 34.67,15.49 U30.12 U30.13 U30.14 36.01,16.88 C41.2 ; U30.29 33.47,12.24 ; 5.55,13.73 6.54,12.74 ; 6.54,12.74 U37.94 ; U37.27 23.58,10.24 v1(23.24,9.9) ; C2.2 25.49,2.55 X6.4 21.48,4.3 X6.2 ; 33.47,12.24 U30.7 39.08,12.24 39.12,12.2 ; 33.47,12.24 33.65,12.07 34.12,11.59 U30.6 39.08,11.59 39.12,11.55 ; v1(22.86,15.11) 23,15.24 U37.37 ; U37.10 15.77,5.81 17.33,4.26 C1.2 16.82,2.86 C4.1 ; U38.2 12.32,29.54 v1(12.36,29.58) ; U37.20 20.77,6.53 v1(20.83,6.47) ; U38.8 9.93,33.12 v1(9.91,33.14) ; v1(12.19,21.2) 11.77,21.62 U37.74 ; C32.2 20.57,32.32 C55.1 C31.1
  vias: v1(7.39,1.26) v1(8.1,1.26) v1(8.51,31.09) v1(8.51,30.37) v1(8.51,29.61) v1(8.87,1.26) v1(16.41,1.14) v1(17.12,1.14) v1(17.88,1.14) v1(22.48,33.52) v1(23.24,33.52) v1(23.95,33.52) v1(24.76,34.67) v1(25.49,34.67) v1(26.24,34.67) v1(28.45,22.98) v1(28.45,22.22) v1(28.49,24.56) v1(28.49,23.8) v1(29.22,24.56) v1(29.18,22.98) v1(29.21,22.22) v1(29.25,23.8) v1(29.92,22.98) v1(29.92,22.22) v1(29.96,24.56) v1(29.96,23.8) v1(47.12,5.43) v1(47.12,4.72) v1(47.12,3.96) v1(47.12,3.15) v1(47.12,2.43) v1(47.12,1.67)
CAN_RX: length 4.7
  Top Layer w0.254: U38.4 14.6,27.32 14.6,25.78 13.77,24.94 U37.70
CAN_TX: length 5.2
  Top Layer w0.254: U37.71 13.27,24.7 11.05,26.92 U38.1
CANH: length 9.1
  Top Layer w0.254: U38.7 12.32,32.13 11.81,31.62 9.91,31.62 R27.2 7.23,34.3 5.55,34.3
CANL: length 9.7
  Top Layer w0.254: 5.55,35.3 7.74,35.3 R27.1 13.22,34.78 13.59,34.41 U38.6
M1-EN: length 17.2
  Top Layer w0.254: U37.45 27.49,19.24 28.57,18.16 28.57,13.08 29.41,12.24 U30.22 31.25,12.24 31.43,12.06 31.43,10.95 ; U30.24 31.42,10.94 31.43,10.95 ; 31.43,10.95 31.43,9.77 31.3,9.64 U30.26
M1-ISENS-1: length 20.8
  Top Layer w0.254: v1(26.29,9.77) 26.26,9.74 U37.26 ; U8.6 41.28,12.26 v1(41.28,13.33)
  Bottom Layer w0.254: v1(26.29,9.77) 35.18,9.77 38.35,12.95 38.35,13.84 39.12,14.6 40.26,14.6 41.28,13.58 v1(41.28,13.33)
M1-ISENS-2: length 20.9
  Top Layer w0.254: U37.29 25.71,11.24 v1(26.29,10.66)
  Top Layer w0.381: v1(41.4,16.5) 41.4,15.82 41.34,15.76
  Bottom Layer w0.254: v1(41.4,16.5) 40.26,16.5 37.85,14.09 37.85,13.22 34.85,10.23 26.72,10.23 v1(26.29,10.66)
M1-PORT-1: length 4.4
  Top Layer w0.508: U8.4 44.07,8.17 R44.1
M1-PORT-2: length 7.1
  Top Layer w0.457: MOTOR1.2 47.71,13.76 R45.1
  Top Layer w0.508: U14.4 42.16,13.76 R45.1
M1-PORT-3: length 15.1
  Top Layer w0.457: 36.01,13.54 37.17,13.54 v1(37.21,13.58)
  Bottom Layer w0.508: v1(48.13,16.83) 47.57,17.39 39.12,17.39 37.21,15.49 v1(37.21,13.58)
M1-PWM-1: length 11.3
  Top Layer w0.254: U37.40 26.03,16.74 26.29,16.49 26.29,12.06 29.36,8.99 U30.27
M1-PWM-2: length 11.3
  Top Layer w0.254: U37.42 26.45,17.74 27.05,17.14 27.05,12.44 29.2,10.29 U30.25
M1-PWM-3: length 11.3
  Top Layer w0.254: U30.23 29.04,11.59 27.81,12.82 27.81,17.78 26.84,18.74 U37.44
MT6701_OUT: length 29.5
  Top Layer w0.254: U37.36 23.89,14.74 v1(22.86,13.71)
  Bottom Layer w0.305: v1(22.86,13.71) 27.43,18.28 27.43,37.08 27.15,37.36 U34.3
NRST: length 22.5
  Top Layer w0.305: v1(7.87,6.73) 6.49,6.73 R1.1 6.48,4.49 C5.2 5.76,4.37 RST1.2 ; U37.14 17.77,9.51 v1(17.78,9.52)
  Bottom Layer w0.305: 8.43,7.03 9.03,7.03 9.03,7.63 ; 8.43,7.03 8.13,6.73 v1(7.87,6.73) ; 8.43,7.03 9.03,7.63 ; 9.03,7.63 10.92,9.52 v1(17.78,9.52)
OSC32_IN: length 8
  Top Layer w0.305: U37.8 14.77,7.08 11.51,3.82 ; C3.1 10.84,4.24 11.51,3.57
OSC32_OUT: length 7.1
  Top Layer w0.305: C4.2 15.27,3.57 14.01,3.57 15.27,4.83 ; 15.27,5.08 U37.9
OSC_IN: length 9.9
  Top Layer w0.254: U37.12 16.77,7.1 19.69,4.19 19.69,2.92 20.05,2.55 ; 20.05,2.55 X6.3 ; 20.05,2.55 18.53,2.55 C1.1
OSC_OUT: length 10.5
  Top Layer w0.305: C2.1 25.72,4.3 X6.1 22.87,4.3 ; U37.13 17.27,7.36 19.18,5.46 21.97,5.46 22.87,4.55
PC6: length 14.9
  Top Layer w0.305: U37.63 17.27,26.16 16,27.43 16,36.4 15.12,37.28
SCL: length 24
  Top Layer w0.254: v1(22.73,37.71) 19.93,37.71 R41.1 ; v1(16,26.28) 15.27,25.55 U37.67
  Bottom Layer w0.254: v1(16,26.28) 16,28.57 22.73,35.3 v1(22.73,37.71) 22.73,38.22 22.32,38.64 U34.7
SDA: length 22.2
  Top Layer w0.254: v1(21.97,36.83) 21.97,36.06 21.34,35.43 R42.1 ; U37.66 15.77,24.63 16,24.86 v1(16,25.14)
  Bottom Layer w0.254: v1(16,25.14) 15.11,26.03 15.11,29.2 21.97,36.06 v1(21.97,36.83) 21.43,37.36 U34.6
SWCLK: length 4.6
  Top Layer w0.254: CN4.2 7.2,24.26 U37.76
SWDIO: length 8.3
  Top Layer w0.254: CN4.3 6.79,25.14 12.06,25.14 12.77,24.43 U37.72
UART_RX: length 6.9
  Top Layer w0.254: U37.83 8.47,18.24 7.75,17.52 7.75,15.36 7.11,14.73 5.55,14.73
UART_TX: length 6.3
  Top Layer w0.254: U37.80 8.7,19.74 5.84,16.89 5.84,16.02 5.55,15.73
$1N4932: length 4
  Top Layer w0.254: U30.1 38.26,6.09 C38.2
$1N4937: length 4.5
  Top Layer w0.305: C41.1 32.32,18.83 U30.15 U30.16 U30.17
$1N5006: length 3.7
  Top Layer w0.254: C15.1 38.22,8.13 36.71,9.64 U30.3
$1N5007: length 5.8
  Top Layer w0.254: C38.1 40.39,6.2 40.39,6.47 39.88,6.98 38.71,6.98 36.69,8.99 U30.2
$1N9353: length 5
  Top Layer w0.305: U5.3 35.99,28.38 R36.2 34.91,29.46 R39.1
$1N9354: length 7.7
  Top Layer w0.305: U5.6 40.01,31.93 C56.2 39.31,33.08 38.61,33.78 36.25,33.78 L8.1
$1N9355: length 2.6
  Top Layer w0.305: U5.1 37.21,31.93 C56.1
$1N9357: length 3.2
  Top Layer w0.305: R38.2 41.46,28.38 U5.4
$1N9890: length 2.7
  Top Layer w0.305: U39.2 13.62,39.32 R14.1
$1N21410: length 4.9
  Top Layer w0.305: 13.61,37.28 13.54,37.28 12.7,36.44 10.37,36.44 9.61,37.2 U6.1
$1N26766: length 9.8
  Top Layer w0.381: U30.5 37.57,10.94 38.48,10.03 39.81,10.03 40.4,10.62 40.4,11.17 40.78,11.55 U8.5
  Top Layer w0.457: U8.5 43.13,11.55 R44.2
$1N26776: length 9.9
  Top Layer w0.381: U14.5 40.89,15.11 40.26,14.47 40.26,13.58 39.75,13.08 38.23,13.08 38.04,12.89 U30.8
  Top Layer w0.457: R45.2 42.21,15.11 U14.5

## Copper pours and planes (outline as drawn; the poured copper is in the pictures)
5V on Top Layer: 23.55,38.04 34.15,38.04 34.15,28.7 23.55,28.7
5V on Bottom Layer: 19.3,40.51 26.88,40.51 26.88,38.16 19.3,38.16
12V on Top Layer: 35.05,10.54 37.21,10.54 37.21,10.03 35.05,10.03
12V on Top Layer: 37.05,38.36 48.25,38.36 48.25,30.49 37.05,30.49
GND on Top Layer: -2.54,57.91 68.33,57.91 68.33,-5.59 -2.54,-5.59
GND on Bottom Layer: -4.95,56.13 62.99,56.13 62.99,-10.67 -4.95,-10.67
M1-PORT-1 on Top Layer: 42.93,11.3 49.53,11.3 49.53,6.6 42.93,6.6
M1-PORT-2 on Top Layer: 42.67,14.73 49.53,14.73 49.53,11.93 42.67,11.93

Small or netless copper shapes (teardrops, artwork), in the pictures only: 213 on Top Layer, 43 on Bottom Layer

## Text on the board
Bottom Silkscreen Layer: C / B' / A' | - | +
Top Silkscreen Layer: + | | | testing_dirver | Ver 1.0.0 | CAN | UART | SWD | POWER | 增高5mm是为了机械臂安装(打孔)，和放置背后的MT6701磁编码器芯片 | 温一壶月光如酒
